# EAGLE schematic 4081_2 (EAGLE 5.10)
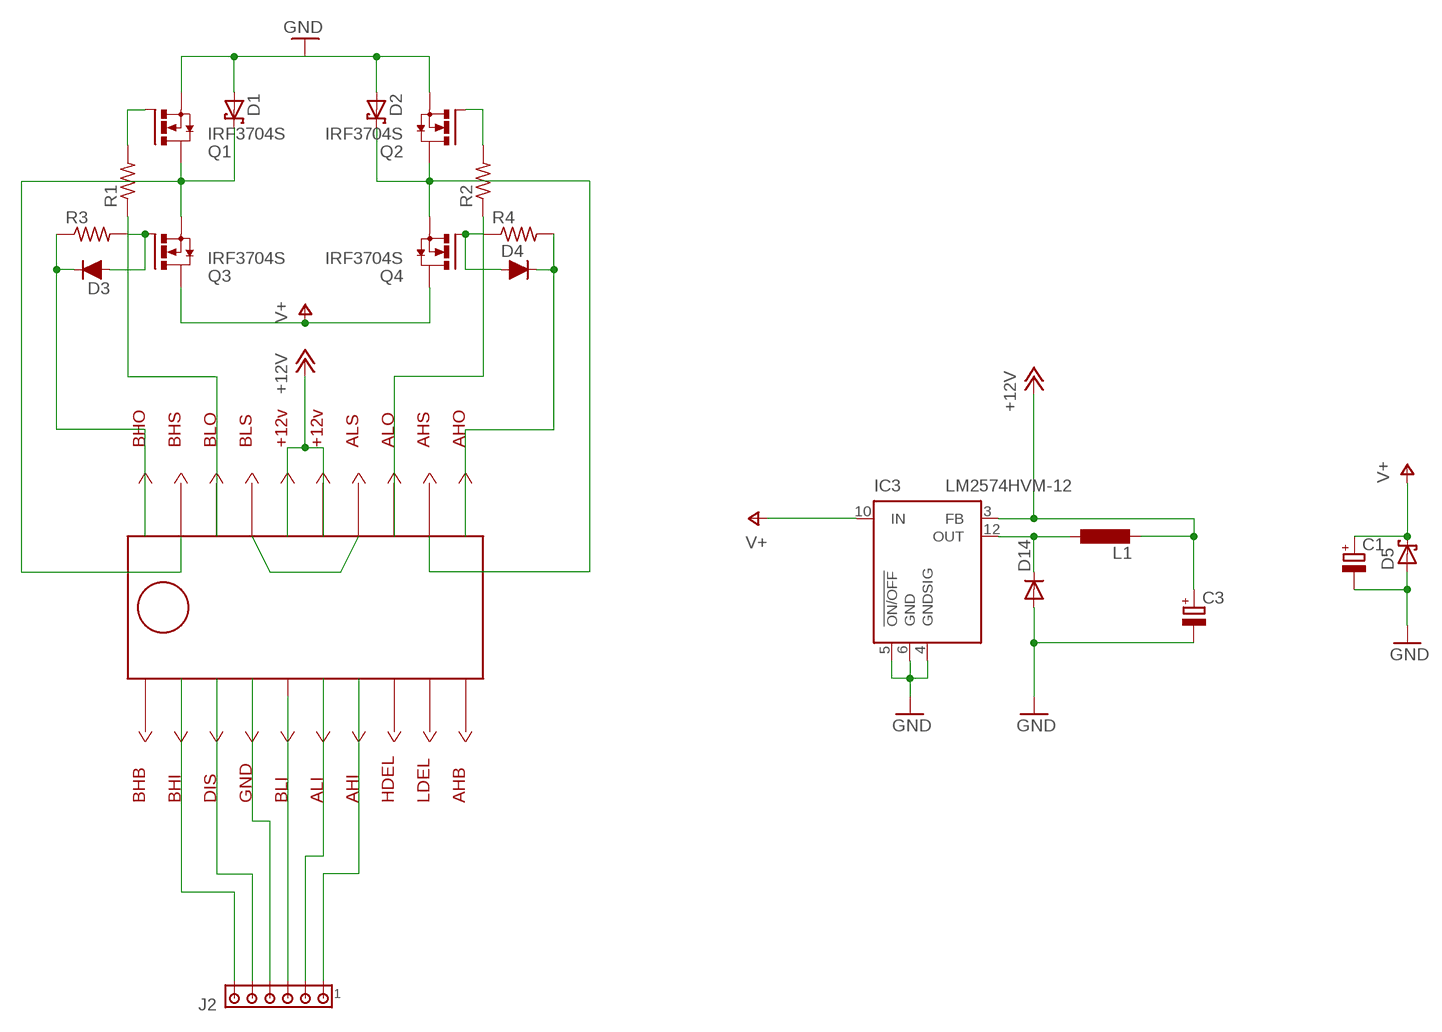
[diagram p0: schematic, sheet 1]

## Parts
C1  CPOL-EUE30-12AXIAL  [E30-12]
C3  CPOL-EU140CLH-1010  [140CLH-1010]
D1  SCHOTTKY-DIODESMC  [SMC]
D2  SCHOTTKY-DIODESMC  [SMC]
D3  D-FILL-MLL-34  [MELF-MLL34]
D4  D-FILL-MLL-34  [MELF-MLL34]
D5  SCHOTTKY-DIODESMC  [SMC]
D14  DIODE-DO214BA  [DO214BA]
IC2  HIP4081_SMD  [20-SOIC]
IC3  LM2574HVM-12  [SO14W]
J2  MTA06-100  [10X06MTA]
L1  L-EUPIS2816  [PIS2816]
Q1  IRF3704S  [D2PACK]
Q2  IRF3704S  [D2PACK]
Q3  IRF3704S  [D2PACK]
Q4  IRF3704S  [D2PACK]
R1  R-US_M1206  [M1206]
R2  R-US_M1206  [M1206]
R3  R-US_M1206  [M1206]
R4  R-US_M1206  [M1206]

## Nets
+12V: C3.+ IC2.15(VCC) IC2.16(+12V) IC3.3(FB) L1.2
AHO2: D4.1(C) IC2.11(AHO) R4.2
AHS2: D2.C IC2.12(AHS) Q2.2(D) Q4.3(S)
ALO2: IC2.13(ALO) R2.1
ALS2: Q3.2(D) Q4.2(D) ; supply symbol labelled V+
BHO2: D3.1(C) IC2.20(BHO) R3.1
BHS2: D1.C IC2.19(BHS) Q1.2(D) Q3.3(S)
BLO2: IC2.18(BLO) R1.1
GND: C1.- C3.- D1.A D2.A D5.A D14.A IC2.14(ALS) IC2.17(BLS) IC3.4(GNDSIG) IC3.5(!ON/OFF) IC3.6(GND) Q1.3(S) Q2.3(S)
N$1: D14.C IC3.12(OUT) L1.1
N$2: Q1.1(G) R1.2
N$3: Q2.1(G) R2.2
N$4: D4.2(A) Q4.1(G) R4.1
N$5: D3.2(A) Q3.1(G) R3.2
N$16: IC2.2(BHI) J2.1
N$17: IC2.3(DIS) J2.2
N$18: IC2.4(GND) J2.3
N$19: J2.4
N$20: IC2.6(ALI) J2.5
N$21: IC2.7(AHI) J2.6
V+: C1.+ D5.C IC3.10(IN)
Unconnected: IC2.1(BHB) IC2.5(BLI) IC2.8(HDEL) IC2.9(LDEL) IC2.10(AHB)

## Library data of the parts
C1 C3 = rcl:CPOL-EU: POLARIZED CAPACITOR, European symbol
D1 D2 D5 = diode:SCHOTTKY-DIODE: Schottky Diode
D3 D4 = semicon-smd-ipc:D-FILL-: DIODE filled
D14 = diode:DIODE-: DIODE
IC2 = A-JD3:HIP4081_SMD
IC3 = linear:LM2574?-*: SIMPLE SWITCHER 0.5A Step-Down Voltage Regulator Source: http://cache.national.com/ds/LM/LM2574.pdf
J2 = con-amp:MTA06-100: AMP connector
L1 = rcl:L-EU: INDUCTOR, European symbol
Q1-Q4 = transistor-power:IRF3704: SMPS MOSFET HEXFET® Power MOSFET Source: http://www.irf.com/product-info/datasheets/data/irf3704.pdf
R1-R4 = rcl:R-US_: RESISTOR, American symbol